# Altium schematic sheet 2403_RAM.SchDoc: RAM
size A4; DrawnBy: SY; Engineer: SY; Organization: R.LAB; DocumentNumber: 2403; Revision: 1; SheetNumber: 3; SheetTotal: 3
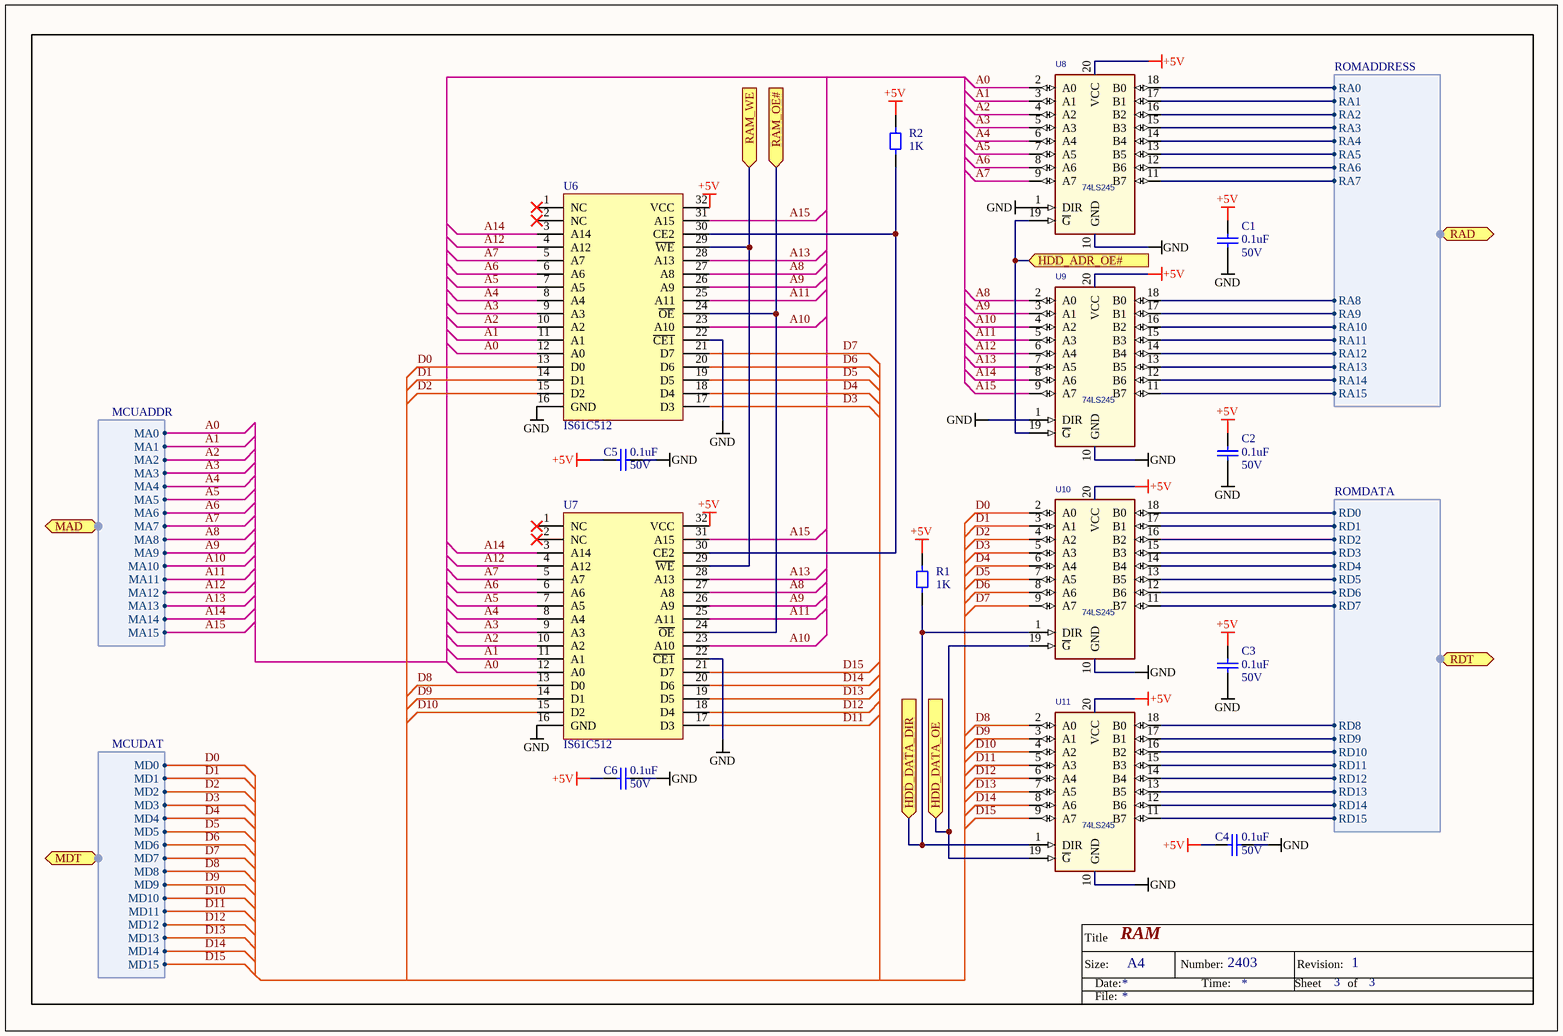
[diagram p0: 2403_RAM.SchDoc]

## Parts
C1  0.1uF  Rated Voltage: 50V  [0805_CAPC2013X100N]
C2  0.1uF  Rated Voltage: 50V  [0805_CAPC2013X100N]
C3  0.1uF  Rated Voltage: 50V  [0805_CAPC2013X100N]
C4  0.1uF  Rated Voltage: 50V  [0805_CAPC2013X100N]
C5  0.1uF  Rated Voltage: 50V  [0805_CAPC2013X100N]
C6  0.1uF  Rated Voltage: 50V  [0805_CAPC2013X100N]
R1  1K  [0805_RESC2013X84N]
R2  1K  [0805_RESC2013X84N]
U6  IS61C512  [DIP32-300]
U7  IS61C512  [DIP32-300]
U8  74LS245  [SOIC127P1030X265-20N]
U9  74LS245  [SOIC127P1030X265-20N]
U10  74LS245  [SOIC127P1030X265-20N]
U11  74LS245  [SOIC127P1030X265-20N]

## Ports
HDD_ADR_OE# (in), HDD_DATA_DIR (in), HDD_DATA_OE (in), MAD (harness MCUADDR), MDT (harness MCUDAT), RAD (harness ROMADDRESS), RAM_OE# (in), RAM_WE (in), RDT (harness ROMDATA)

## Harnesses
ROMDATA: RD0, RD1, RD2, RD3, RD4, RD5, RD6, RD7, RD8, RD9, RD10, RD11, RD12, RD13, RD14, RD15
ROMADDRESS: RA0, RA1, RA2, RA3, RA4, RA5, RA6, RA7, RA8, RA9, RA10, RA11, RA12, RA13, RA14, RA15
MCUADDR: MA0, MA1, MA2, MA3, MA4, MA5, MA6, MA7, MA8, MA9, MA10, MA11, MA12, MA13, MA14, MA15
MCUDAT: MD0, MD1, MD2, MD3, MD4, MD5, MD6, MD7, MD8, MD9, MD10, MD11, MD12, MD13, MD14, MD15

## Nets
+5V: C1.2 C2.2 C3.2 C4.2 C5.2 C6.2 R1.2 R2.2 U6.32(VCC) U7.32(VCC) U8.20(VCC) U9.20(VCC) U10.20(VCC) U11.20(VCC)  [also labelled VCC]
GND: C1.1 C2.1 C3.1 C4.1 C5.1 C6.1 U6.16(GND) U6.22(~{CE1}) U7.16(GND) U7.22(~{CE1}) U8.1(DIR) U8.10(GND) U9.1(DIR) U9.10(GND) U10.10(GND) U11.10(GND)
A0: U6.12(A0) U7.12(A0) U8.2(A0) ; port MAD.MA0
A1: U6.11(A1) U7.11(A1) U8.3(A1) ; port MAD.MA1
A2: U6.10(A2) U7.10(A2) U8.4(A2) ; port MAD.MA2
A3: U6.9(A3) U7.9(A3) U8.5(A3) ; port MAD.MA3
A4: U6.8(A4) U7.8(A4) U8.6(A4) ; port MAD.MA4
A5: U6.7(A5) U7.7(A5) U8.7(A5) ; port MAD.MA5
A6: U6.6(A6) U7.6(A6) U8.8(A6) ; port MAD.MA6
A7: U6.5(A7) U7.5(A7) U8.9(A7) ; port MAD.MA7
A8: U6.27(A8) U7.27(A8) U9.2(A0) ; port MAD.MA8
A9: U6.26(A9) U7.26(A9) U9.3(A1) ; port MAD.MA9
A10: U6.23(A10) U7.23(A10) U9.4(A2) ; port MAD.MA10
A11: U6.25(A11) U7.25(A11) U9.5(A3) ; port MAD.MA11
A12: U6.4(A12) U7.4(A12) U9.6(A4) ; port MAD.MA12
A13: U6.28(A13) U7.28(A13) U9.7(A5) ; port MAD.MA13
A14: U6.3(A14) U7.3(A14) U9.8(A6) ; port MAD.MA14
A15: U6.31(A15) U7.31(A15) U9.9(A7) ; port MAD.MA15
D0: U6.13(D0) U10.2(A0) ; port MDT.MD0
D1: U6.14(D1) U10.3(A1) ; port MDT.MD1
D2: U6.15(D2) U10.4(A2) ; port MDT.MD2
D3: U6.17(D3) U10.5(A3) ; port MDT.MD3
D4: U6.18(D4) U10.6(A4) ; port MDT.MD4
D5: U6.19(D5) U10.7(A5) ; port MDT.MD5
D6: U6.20(D6) U10.8(A6) ; port MDT.MD6
D7: U6.21(D7) U10.9(A7) ; port MDT.MD7
D8: U7.13(D0) U11.2(A0) ; port MDT.MD8
D9: U7.14(D1) U11.3(A1) ; port MDT.MD9
D10: U7.15(D2) U11.4(A2) ; port MDT.MD10
D11: U7.17(D3) U11.5(A3) ; port MDT.MD11
D12: U7.18(D4) U11.6(A4) ; port MDT.MD12
D13: U7.19(D5) U11.7(A5) ; port MDT.MD13
D14: U7.20(D6) U11.8(A6) ; port MDT.MD14
D15: U7.21(D7) U11.9(A7) ; port MDT.MD15
HDD_ADR_OE#: U8.19(~{G}) U9.19(~{G}) ; port HDD_ADR_OE#
HDD_DATA_DIR: R1.1 U10.1(DIR) U11.1(DIR) ; port HDD_DATA_DIR
HDD_DATA_OE: U10.19(~{G}) U11.19(~{G}) ; port HDD_DATA_OE
RAM_OE#: U6.24(~{OE}) U7.24(~{OE}) ; port RAM_OE#
RAM_WE: U6.29(~{WE}) U7.29(~{WE}) ; port RAM_WE
NetR2_1: R2.1 U6.30(CE2) U7.30(CE2)
NetU8_11: U8.11(B7) ; port RAD.RA7
NetU8_12: U8.12(B6) ; port RAD.RA6
NetU8_13: U8.13(B5) ; port RAD.RA5
NetU8_14: U8.14(B4) ; port RAD.RA4
NetU8_15: U8.15(B3) ; port RAD.RA3
NetU8_16: U8.16(B2) ; port RAD.RA2
NetU8_17: U8.17(B1) ; port RAD.RA1
NetU8_18: U8.18(B0) ; port RAD.RA0
NetU9_11: U9.11(B7) ; port RAD.RA15
NetU9_12: U9.12(B6) ; port RAD.RA14
NetU9_13: U9.13(B5) ; port RAD.RA13
NetU9_14: U9.14(B4) ; port RAD.RA12
NetU9_15: U9.15(B3) ; port RAD.RA11
NetU9_16: U9.16(B2) ; port RAD.RA10
NetU9_17: U9.17(B1) ; port RAD.RA9
NetU9_18: U9.18(B0) ; port RAD.RA8
NetU10_11: U10.11(B7) ; port RDT.RD7
NetU10_12: U10.12(B6) ; port RDT.RD6
NetU10_13: U10.13(B5) ; port RDT.RD5
NetU10_14: U10.14(B4) ; port RDT.RD4
NetU10_15: U10.15(B3) ; port RDT.RD3
NetU10_16: U10.16(B2) ; port RDT.RD2
NetU10_17: U10.17(B1) ; port RDT.RD1
NetU10_18: U10.18(B0) ; port RDT.RD0
NetU11_11: U11.11(B7) ; port RDT.RD15
NetU11_12: U11.12(B6) ; port RDT.RD14
NetU11_13: U11.13(B5) ; port RDT.RD13
NetU11_14: U11.14(B4) ; port RDT.RD12
NetU11_15: U11.15(B3) ; port RDT.RD11
NetU11_16: U11.16(B2) ; port RDT.RD10
NetU11_17: U11.17(B1) ; port RDT.RD9
NetU11_18: U11.18(B0) ; port RDT.RD8

Not connected (* = marked no-connect by the designer): U6 1(NC)* 2(NC)*; U7 1(NC)* 2(NC)*

## Notes on the sheet
- Title
- Size:
- Date:
- A4
- Number:
- Time:
- Sheet
- Revision:
- of
- File:

## Library data of the parts
C1-C6 = Cap SMD: Capacitor SMD; Suppler: chips; VALUE: 0.1uF; PackageReference: 0805; Publisher: SY; Price: 1
R1 R2 = Resistor SMD L: SMD Resistor; Tolerance: 5%; Power: 0.1W; VALUE: 1K; Publisher: SY; Price: *; Suppler: *; Package: 0805
U6 U7 = IS61C512: 64KB static RAM; Suppler: xlam; Source: 2403; Publisher: SY; Price: 0
U8-U11 = 74ABT245: Bus former; Suppler: xlam; Publisher: SY; Price: ?